# EAGLE design Insoladora (EAGLE 6.4)
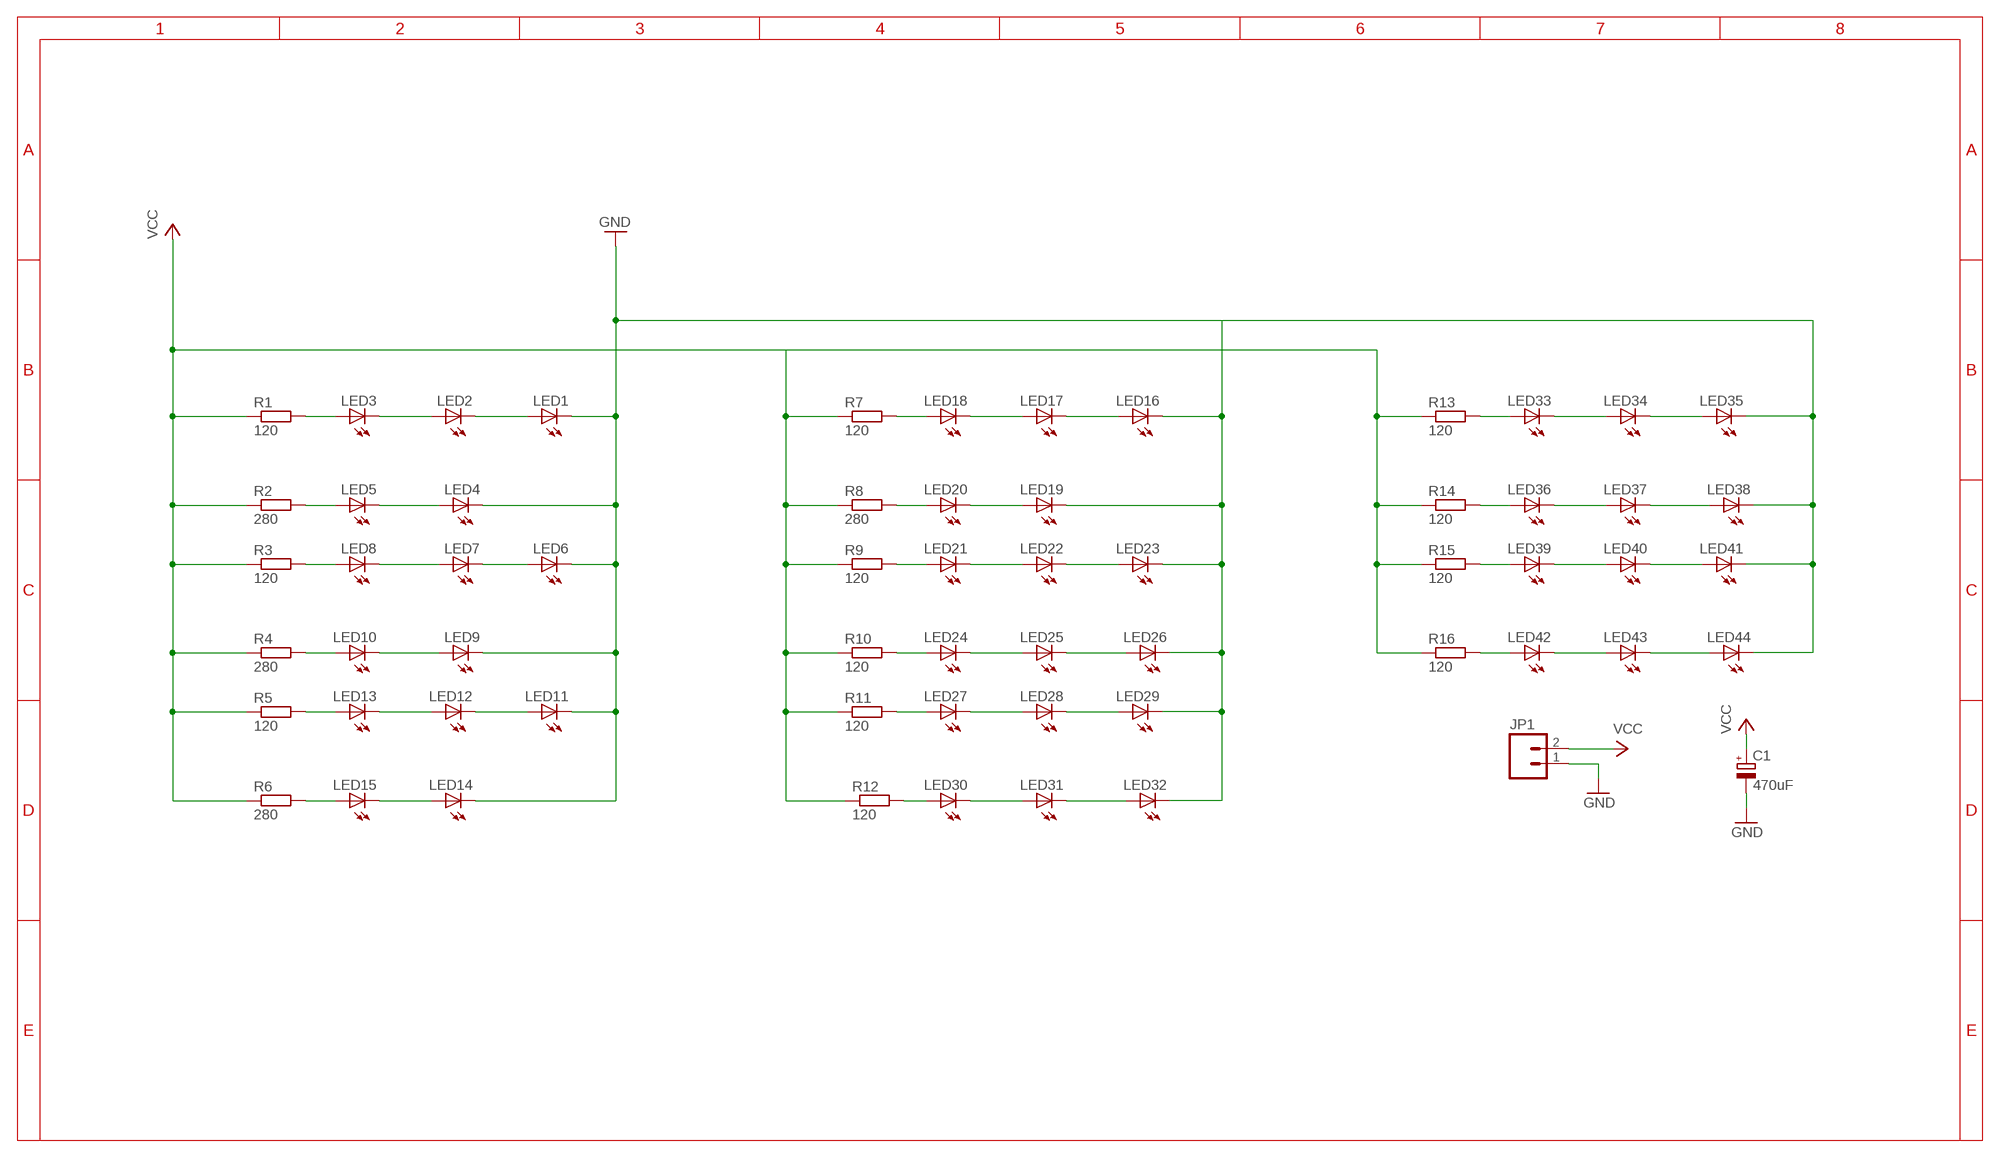
[diagram p0: schematic, sheet 1]

## Parts
C1  470uF  CPOL-EUE2.5-7  [E2,5-7]
JP1  M023.5MM_LOCK  [SCREWTERMINAL-3.5MM-2_LOCK]
LED1  LED5MM  [LED5MM]
LED2  LED5MM  [LED5MM]
LED3  LED5MM  [LED5MM]
LED4  LED5MM  [LED5MM]
LED5  LED5MM  [LED5MM]
LED6  LED5MM  [LED5MM]
LED7  LED5MM  [LED5MM]
LED8  LED5MM  [LED5MM]
LED9  LED5MM  [LED5MM]
LED10  LED5MM  [LED5MM]
LED11  LED5MM  [LED5MM]
LED12  LED5MM  [LED5MM]
LED13  LED5MM  [LED5MM]
LED14  LED5MM  [LED5MM]
LED15  LED5MM  [LED5MM]
LED16  LED5MM  [LED5MM]
LED17  LED5MM  [LED5MM]
LED18  LED5MM  [LED5MM]
LED19  LED5MM  [LED5MM]
LED20  LED5MM  [LED5MM]
LED21  LED5MM  [LED5MM]
LED22  LED5MM  [LED5MM]
LED23  LED5MM  [LED5MM]
LED24  LED5MM  [LED5MM]
LED25  LED5MM  [LED5MM]
LED26  LED5MM  [LED5MM]
LED27  LED5MM  [LED5MM]
LED28  LED5MM  [LED5MM]
LED29  LED5MM  [LED5MM]
LED30  LED5MM  [LED5MM]
LED31  LED5MM  [LED5MM]
LED32  LED5MM  [LED5MM]
LED33  LED5MM  [LED5MM]
LED34  LED5MM  [LED5MM]
LED35  LED5MM  [LED5MM]
LED36  LED5MM  [LED5MM]
LED37  LED5MM  [LED5MM]
LED38  LED5MM  [LED5MM]
LED39  LED5MM  [LED5MM]
LED40  LED5MM  [LED5MM]
LED41  LED5MM  [LED5MM]
LED42  LED5MM  [LED5MM]
LED43  LED5MM  [LED5MM]
LED44  LED5MM  [LED5MM]
R1  120  R-EU_0207/10  [0207/10]
R2  280  R-EU_0207/10  [0207/10]
R3  120  R-EU_0207/10  [0207/10]
R4  280  R-EU_0207/10  [0207/10]
R5  120  R-EU_0207/10  [0207/10]
R6  280  R-EU_0207/10  [0207/10]
R7  120  R-EU_0207/10  [0207/10]
R8  280  R-EU_0207/10  [0207/10]
R9  120  R-EU_0207/10  [0207/10]
R10  120  R-EU_0207/10  [0207/10]
R11  120  R-EU_0207/10  [0207/10]
R12  120  R-EU_0207/10  [0207/10]
R13  120  R-EU_0207/10  [0207/10]
R14  120  R-EU_0207/10  [0207/10]
R15  120  R-EU_0207/10  [0207/10]
R16  120  R-EU_0207/10  [0207/10]

## Nets
GND: C1.- JP1.1 LED1.K(C) LED4.K(C) LED6.K(C) LED9.K(C) LED11.K(C) LED14.K(C) LED16.K(C) LED19.K(C) LED23.K(C) LED26.K(C) LED29.K(C) LED32.K(C) LED35.K(C) LED38.K(C) LED41.K(C) LED44.K(C)
N$1: LED3.A R1.2
N$2: LED2.A LED3.K(C)
N$3: LED1.A LED2.K(C)
N$4: LED5.A R2.2
N$5: LED4.A LED5.K(C)
N$6: LED8.A R3.2
N$7: LED7.A LED8.K(C)
N$8: LED21.A R9.2
N$9: LED6.A LED7.K(C)
N$10: LED24.A R10.2
N$11: LED10.A R4.2
N$12: LED9.A LED10.K(C)
N$13: LED30.A R12.2
N$14: LED13.A R5.2
N$15: LED42.A R16.2
N$16: LED21.K(C) LED22.A
N$17: LED22.K(C) LED23.A
N$18: LED33.A R13.2
N$19: LED18.A R7.2
N$20: LED12.A LED13.K(C)
N$21: LED17.A LED18.K(C)
N$22: LED16.A LED17.K(C)
N$23: LED11.A LED12.K(C)
N$24: LED24.K(C) LED25.A
N$25: LED25.K(C) LED26.A
N$26: LED15.A R6.2
N$27: LED27.K(C) LED28.A
N$28: LED28.K(C) LED29.A
N$29: LED14.A LED15.K(C)
N$30: LED30.K(C) LED31.A
N$31: LED31.K(C) LED32.A
N$32: LED20.A R8.2
N$33: LED33.K(C) LED34.A
N$34: LED34.K(C) LED35.A
N$35: LED19.A LED20.K(C)
N$36: LED36.K(C) LED37.A
N$37: LED37.K(C) LED38.A
N$39: LED39.K(C) LED40.A
N$40: LED40.K(C) LED41.A
N$42: LED42.K(C) LED43.A
N$43: LED43.K(C) LED44.A
N$52: LED27.A R11.2
N$57: LED36.A R14.2
N$58: LED39.A R15.2
VCC: C1.+ JP1.2 R1.1 R2.1 R3.1 R4.1 R5.1 R6.1 R7.1 R8.1 R9.1 R10.1 R11.1 R12.1 R13.1 R14.1 R15.1 R16.1

## Library data of the parts
C1 = rcl:CPOL-EU: POLARIZED CAPACITOR, European symbol
JP1 = SparkFun-Connectors:M02: Header 2 Standard 2-pin 0.1" header. Use with straight break away headers (SKU : PRT-00116), right angle break away headers (PRT-00553), swiss pins (PRT-00743), machine pins (PRT-00117), and female headers (PRT-00115). Molex polarized connector foot print use with SKU : PRT-08233 with associated crimp pins and housings.
LED1-LED44 = led:LED: LED OSRAM: - CHIPLED LG R971, LG N971, LY N971, LG Q971, LY Q971, LO R971, LY R971 LH N974, LH R974 LS Q976, LO Q976, LY Q976 LO Q996 - Hyper CHIPLED LW Q18S LB Q993, LB Q99A, LB R99A - SideLED LS A670, LO A670, LY A670, LG A670, LP A670 LB A673, LV A673, LT A673, LW A673 LH A674 LY A675 LS A676, LA A676, LO A676, LY A676, LW A676 LS A679, LY A679, LG A679 - Hyper Micro SIDELED® LS Y876, LA Y876, LO Y876, LY Y876 LT Y87S - SmartLED LW L88C, LW L88S LB L89C, LB L89S, LG L890 LS L89K, LO L89K, LY L89K LS L896, LA L896, LO L896, LY L896 - TOPLED LS T670, LO T670, LY T670, LG T670, LP T670 LSG T670, LSP T670, LSY T670, LOP T670, LYG T670 LG T671, LOG T671, LSG T671 LB T673, LV T673, LT T673, LW T673 LH T674 LS T676, LA T676, LO T676, LY T676, LB T676, LH T676, LSB T676, LW T676 LB T67C, LV T67C, LT T67C, LS T67K, LO T67K, LY T67K, LW E67C LS E67B, LA E67B, LO E67B, LY E67B, LB E67C, LV E67C, LT E67C LW T67C LS T679, LY T679, LG T679 LS T770, LO T770, LY T770, LG T770, LP T770 LB T773, LV T773, LT T773, LW T773 LH T774 LS E675, LA E675, LY E675, LS T675 LS T776, LA T776, LO T776, LY T776, LB T776 LHGB T686 LT T68C, LB T68C - Hyper Mini TOPLED® LB M676 - Mini TOPLED Santana® LG M470 LS M47K, LO M47K, LY M47K Source: http://www.osram.convergy.de LUXEON: - LUMILED® LXK2-PW12-R00, LXK2-PW12-S00, LXK2-PW14-U00, LXK2-PW14-V00 LXK2-PM12-R00, LXK2-PM12-S00, LXK2-PM14-U00 LXK2-PE12-Q00, LXK2-PE12-R00, LXK2-PE12-S00, LXK2-PE14-T00, LXK2-PE14-U00 LXK2-PB12-K00, LXK2-PB12-L00, LXK2-PB12-M00, LXK2-PB14-N00, LXK2-PB14-P00, LXK2-PB14-Q00 LXK2-PR12-L00, LXK2-PR12-M00, LXK2-PR14-Q00, LXK2-PR14-R00 LXK2-PD12-Q00, LXK2-PD12-R00, LXK2-PD12-S00 LXK2-PH12-R00, LXK2-PH12-S00 LXK2-PL12-P00, LXK2-PL12-Q00, LXK2-PL12-R00 Source: www.luxeon.com KINGBRIGHT: KA-3528ASYC Source: www.kingbright.com
R1-R16 = rcl:R-EU_: RESISTOR, European symbol

## Board
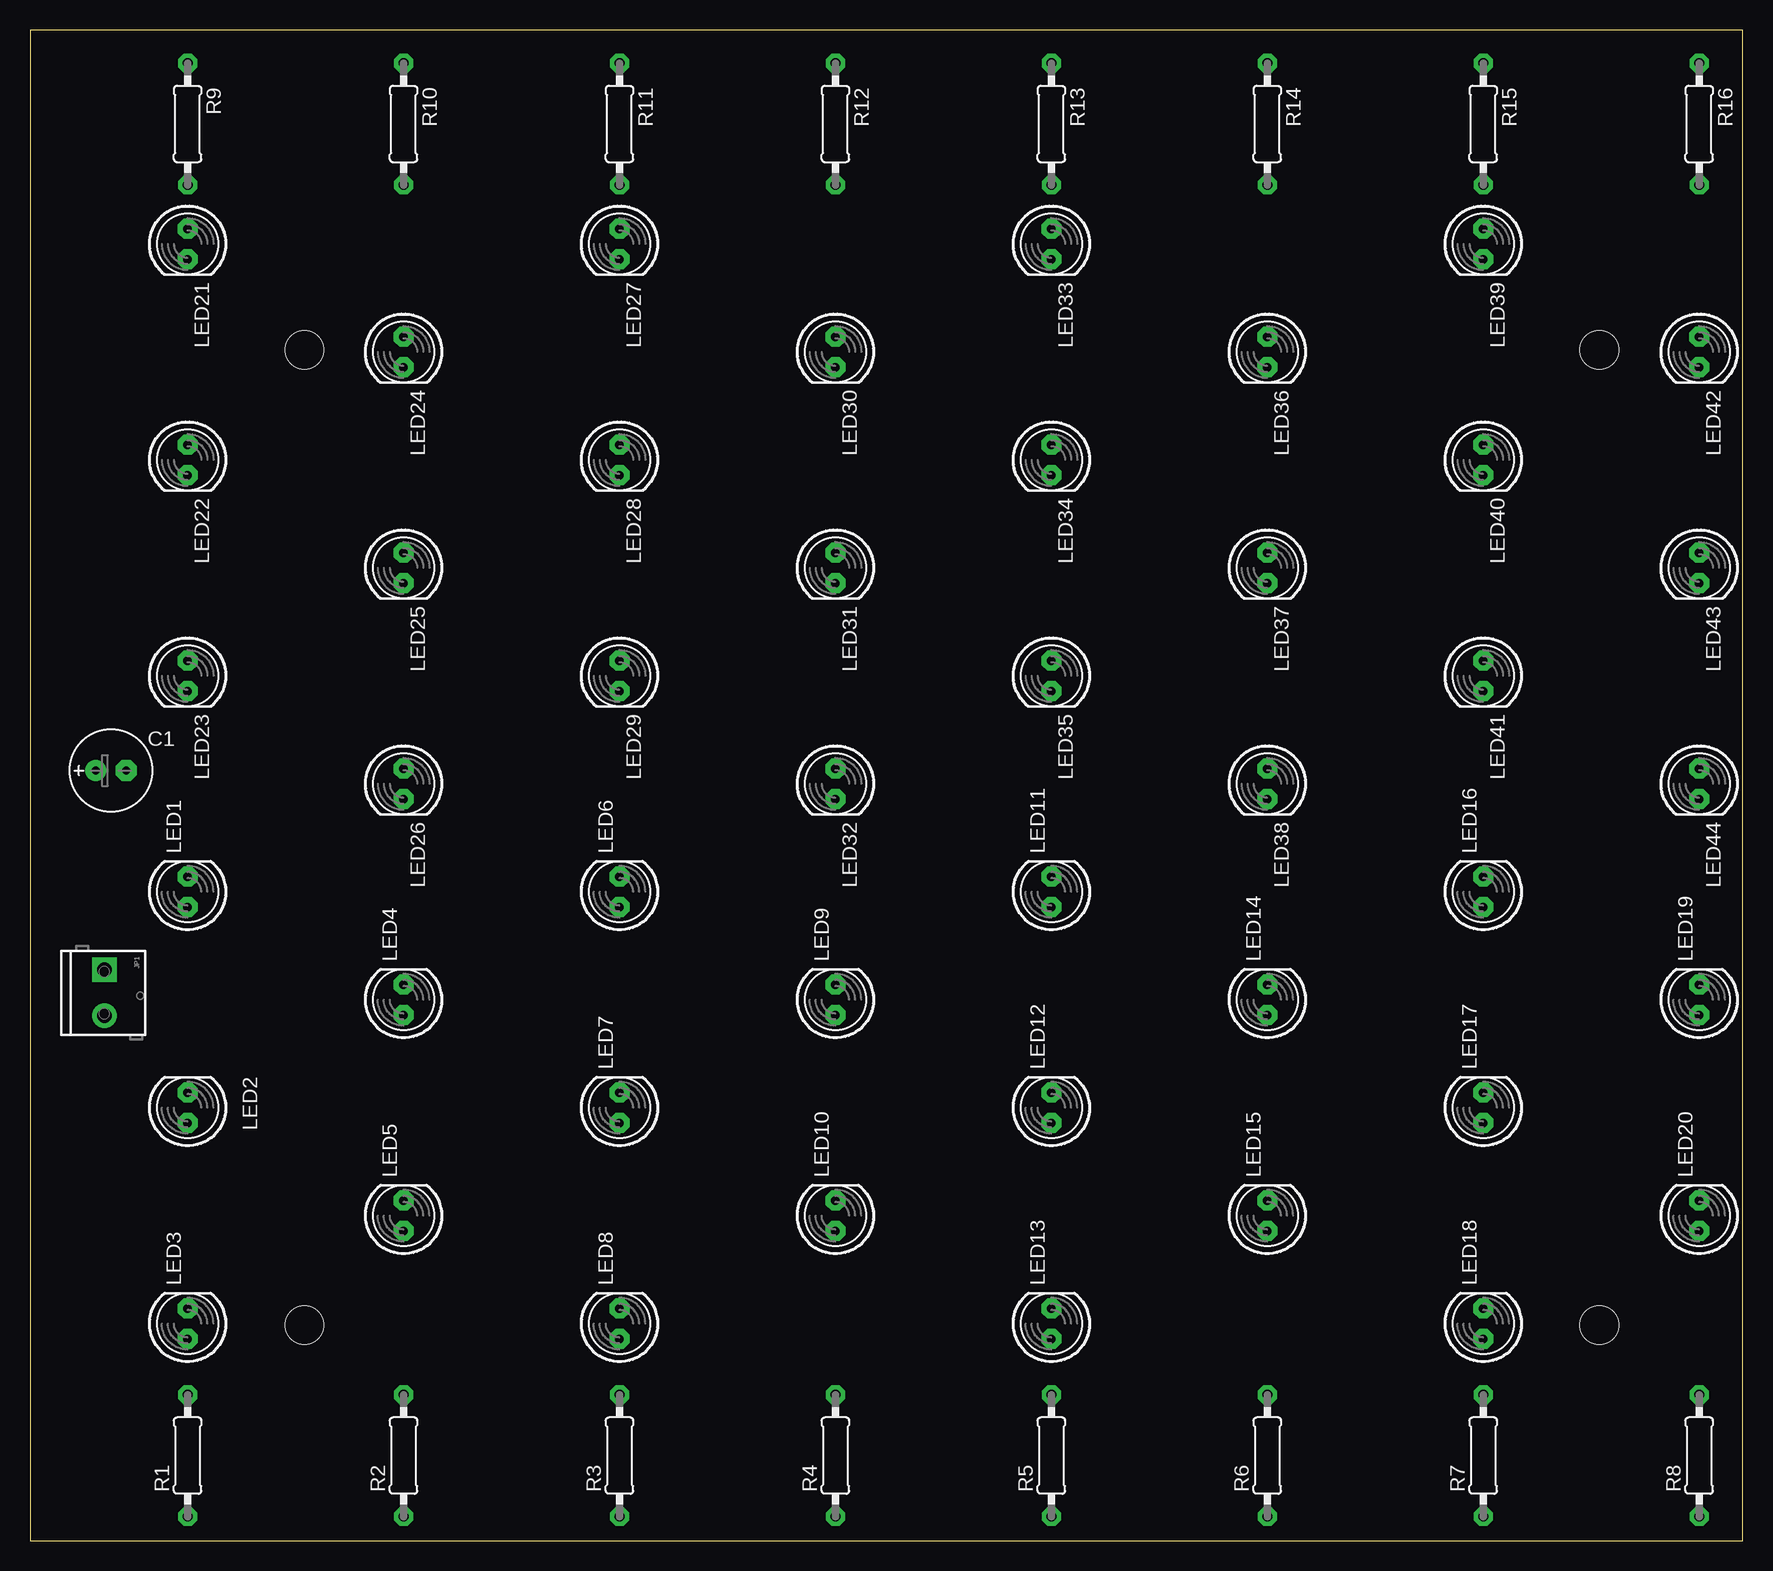
[diagram p1: board, top side]
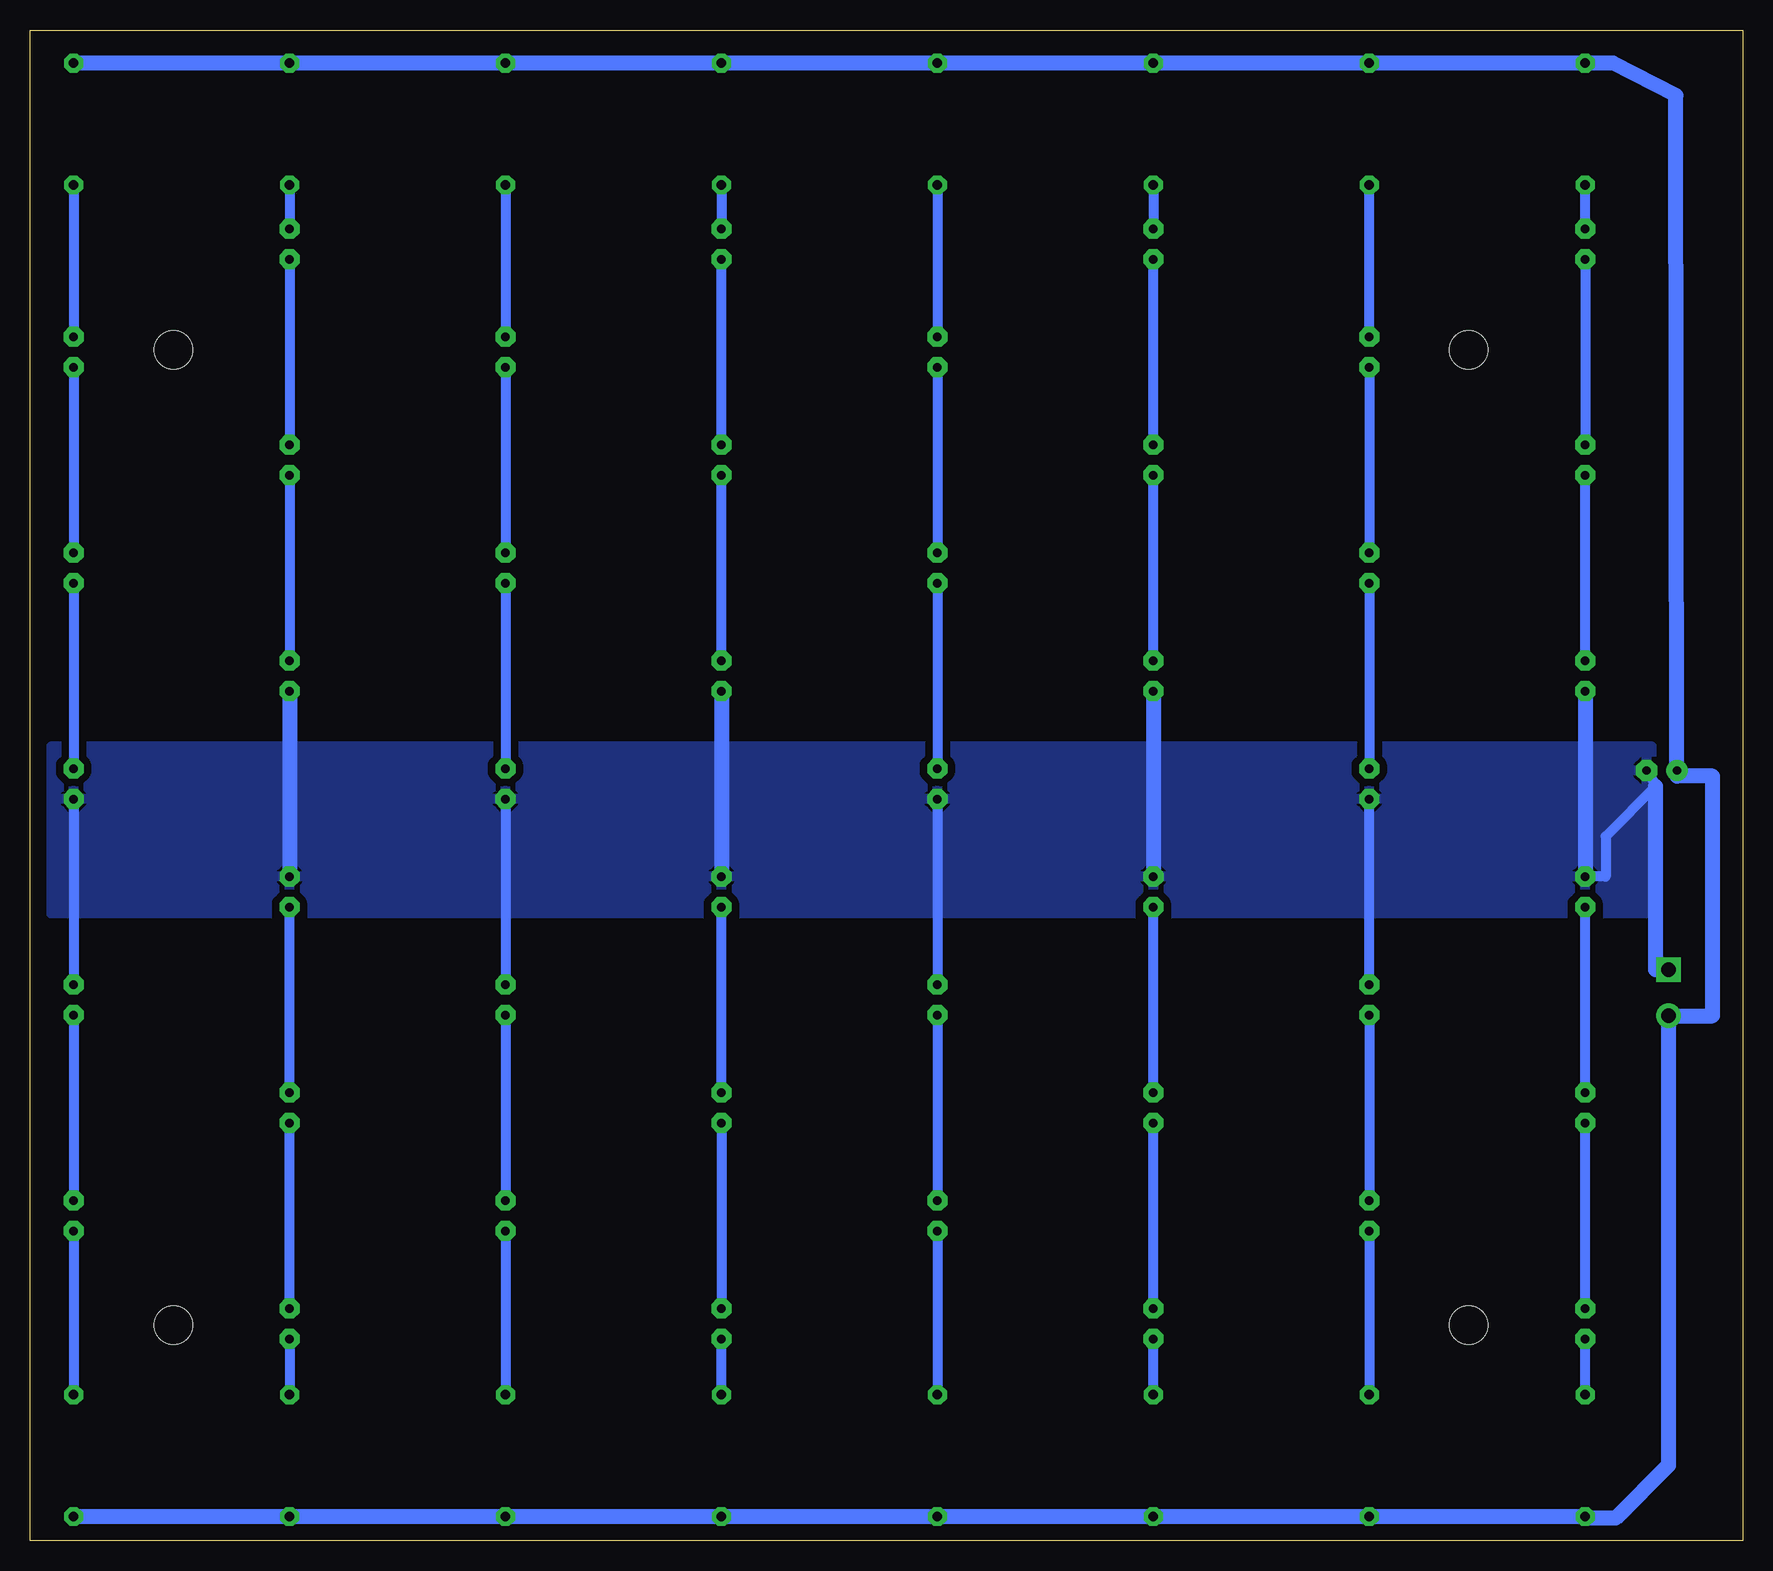
[diagram p2: board, bottom side, seen from below]

Size 142.77 x 125.95 mm. Coordinates in mm from the lower left corner, seen from the top.
Outline: 0,0 142.77,0 142.77,125.95 0,125.95 0,0
Copper layers (1*16): Top 0.035mm / dielectric 1.5mm / Bottom 0.035mm
Design rules "default *": minimum track width 10mil, minimum drill 24mil, track to track 25mil, track to pad 20mil, pad to pad 15mil, via to via 8mil, smd to smd 8mil, copper to edge 40mil, drill to drill 8mil, minimum pad ring 15mil, minimum via ring 8mil, stop-mask expansion 4mil, vias tented up to drill 0mil, thermal gap 10mil
Holes 3.2 mm at 22.86,99.28 130.81,99.28 22.86,18 130.81,18

### Footprints (pad centres in the part's own frame; a part is rotated, then mirrored left to right if it is on the bottom)
E2,5-7 = drill 0.7 pad 1.778: + -1.27,0 | drill 0.7 pad 1.778 octagon: - 1.27,0
SCREWTERMINAL-3.5MM-2_LOCK = drill 1.2 pad 2.032 square: 1 -0.178,0 | drill 1.2 pad 2.032: 2 3.678,0
LED5MM = drill 0.7 pad 1.676 octagon: A -1.27,0; K 1.27,0
0207/10 = drill 0.813 octagon: 1 -5.08,0; 2 5.08,0

### Placement (x,y rotation side)
C1  6.75,64.22 0 top
JP1  6.19,47.45 270 top
LED1  13.14,54.11 90 top
LED2  13.14,36.11 90 top
LED3  13.14,18.11 90 top
LED4  31.14,45.11 90 top
LED5  31.14,27.11 90 top
LED6  49.14,54.11 90 top
LED7  49.14,36.11 90 top
LED8  49.14,18.11 90 top
LED9  67.14,45.11 90 top
LED10  67.14,27.11 90 top
LED11  85.14,54.11 90 top
LED12  85.14,36.11 90 top
LED13  85.14,18.11 90 top
LED14  103.14,45.11 90 top
LED15  103.14,27.11 90 top
LED16  121.14,54.11 90 top
LED17  121.14,36.11 90 top
LED18  121.14,18.11 90 top
LED19  139.14,45.11 90 top
LED20  139.14,27.11 90 top
LED21  13.14,108.11 270 top
LED22  13.14,90.11 270 top
LED23  13.14,72.11 270 top
LED24  31.14,99.11 270 top
LED25  31.14,81.11 270 top
LED26  31.14,63.11 270 top
LED27  49.14,108.11 270 top
LED28  49.14,90.11 270 top
LED29  49.14,72.11 270 top
LED30  67.14,99.11 270 top
LED31  67.14,81.11 270 top
LED32  67.14,63.11 270 top
LED33  85.14,108.11 270 top
LED34  85.14,90.11 270 top
LED35  85.14,72.11 270 top
LED36  103.14,99.11 270 top
LED37  103.14,81.11 270 top
LED38  103.14,63.11 270 top
LED39  121.14,108.11 270 top
LED40  121.14,90.11 270 top
LED41  121.14,72.11 270 top
LED42  139.14,99.11 270 top
LED43  139.14,81.11 270 top
LED44  139.14,63.11 270 top
R1  13.14,7.11 90 top
R2  31.14,7.11 90 top
R3  49.14,7.11 90 top
R4  67.14,7.11 90 top
R5  85.14,7.11 90 top
R6  103.14,7.11 90 top
R7  121.14,7.11 90 top
R8  139.14,7.11 90 top
R9  13.14,118.11 270 top
R10  31.14,118.11 270 top
R11  49.14,118.11 270 top
R12  67.14,118.11 270 top
R13  85.14,118.11 270 top
R14  103.14,118.11 270 top
R15  121.14,118.11 270 top
R16  139.14,118.11 270 top

### Tracks (layer width: path | path; a pad name or v marks a point on that pad's centre or on a via)
GND
  Bottom 0.813: LED4.K LED26.K | LED32.K LED9.K | LED38.K LED14.K | LED44.K LED19.K | LED1.K 11.43,55.38 11.43,58.74 7.26,62.91 C1.-
  Bottom 1.27: JP1.1 7.26,47.63 7.26,62.91 | LED29.K LED6.K | LED35.K LED11.K | LED41.K LED16.K | LED23.K LED1.K
  pour Bottom: 7.62,66.26 7.62,52.29 140.97,52.29 140.97,66.26
N$1
  Bottom 0.813: R1.2 LED3.A
N$2
  Bottom 0.813: LED3.K LED2.A
N$3
  Bottom 0.813: LED2.K LED1.A
N$4
  Bottom 0.813: LED5.A R2.2
N$5
  Bottom 0.813: LED4.A LED5.K
N$6
  Bottom 0.813: R3.2 LED8.A
N$7
  Bottom 0.813: LED8.K LED7.A
N$8
  Bottom 0.813: LED21.A R9.2
N$9
  Bottom 0.813: LED7.K LED6.A
N$10
  Bottom 0.813: LED24.A R10.2
N$11
  Bottom 0.813: LED10.A R4.2
N$12
  Bottom 0.813: LED9.A LED10.K
N$13
  Bottom 0.813: R12.2 LED30.A
N$14
  Bottom 0.813: R5.2 LED13.A
N$15
  Bottom 0.813: R16.2 LED42.A
N$16
  Bottom 0.813: LED21.K LED22.A
N$17
  Bottom 0.813: LED23.A LED22.K
N$18
  Bottom 0.813: R13.2 LED33.A
N$19
  Bottom 0.813: LED18.A R7.2
N$20
  Bottom 0.813: LED12.A LED13.K
N$21
  Bottom 0.813: LED18.K LED17.A
N$22
  Bottom 0.813: LED17.K LED16.A
N$23
  Bottom 0.813: LED12.K LED11.A
N$24
  Bottom 0.813: LED24.K LED25.A
N$25
  Bottom 0.813: LED25.K LED26.A
N$26
  Bottom 0.813: LED15.A R6.2
N$27
  Bottom 0.813: LED28.A LED27.K
N$28
  Bottom 0.813: LED29.A LED28.K
N$29
  Bottom 0.813: LED14.A LED15.K
N$30
  Bottom 0.813: LED30.K LED31.A
N$31
  Bottom 0.813: LED31.K LED32.A
N$32
  Bottom 0.813: LED20.A R8.2
N$33
  Bottom 0.813: LED34.A LED33.K
N$34
  Bottom 0.813: LED35.A LED34.K
N$35
  Bottom 0.813: LED19.A LED20.K
N$36
  Bottom 0.813: LED36.K LED37.A
N$37
  Bottom 0.813: LED37.K LED38.A
N$39
  Bottom 0.813: LED39.K LED40.A
N$40
  Bottom 0.813: LED40.K LED41.A
N$42
  Bottom 0.813: LED42.K LED43.A
N$43
  Bottom 0.813: LED43.K LED44.A
N$52
  Bottom 0.813: R11.2 LED27.A
N$57
  Bottom 0.813: R14.2 LED36.A
N$58
  Bottom 0.813: R15.2 LED39.A
VCC
  Bottom 1.27: R16.1 R15.1 R14.1 R13.1 R12.1 R11.1 R10.1 R9.1 10.79,123.18 5.58,120.51 C1.+ 5.48,63.76 2.52,63.76 2.52,43.77 JP1.2 6.2,6.3 10.59,1.9 13.01,1.9 R1.1 R2.1 R3.1 R4.1 R5.1 R6.1 R7.1 R8.1

### Text on the board
Reference: GND / VCC